# EAGLE board Utable_epaper_32seg_rev2 (EAGLE 6.5.0), part 1 of 2
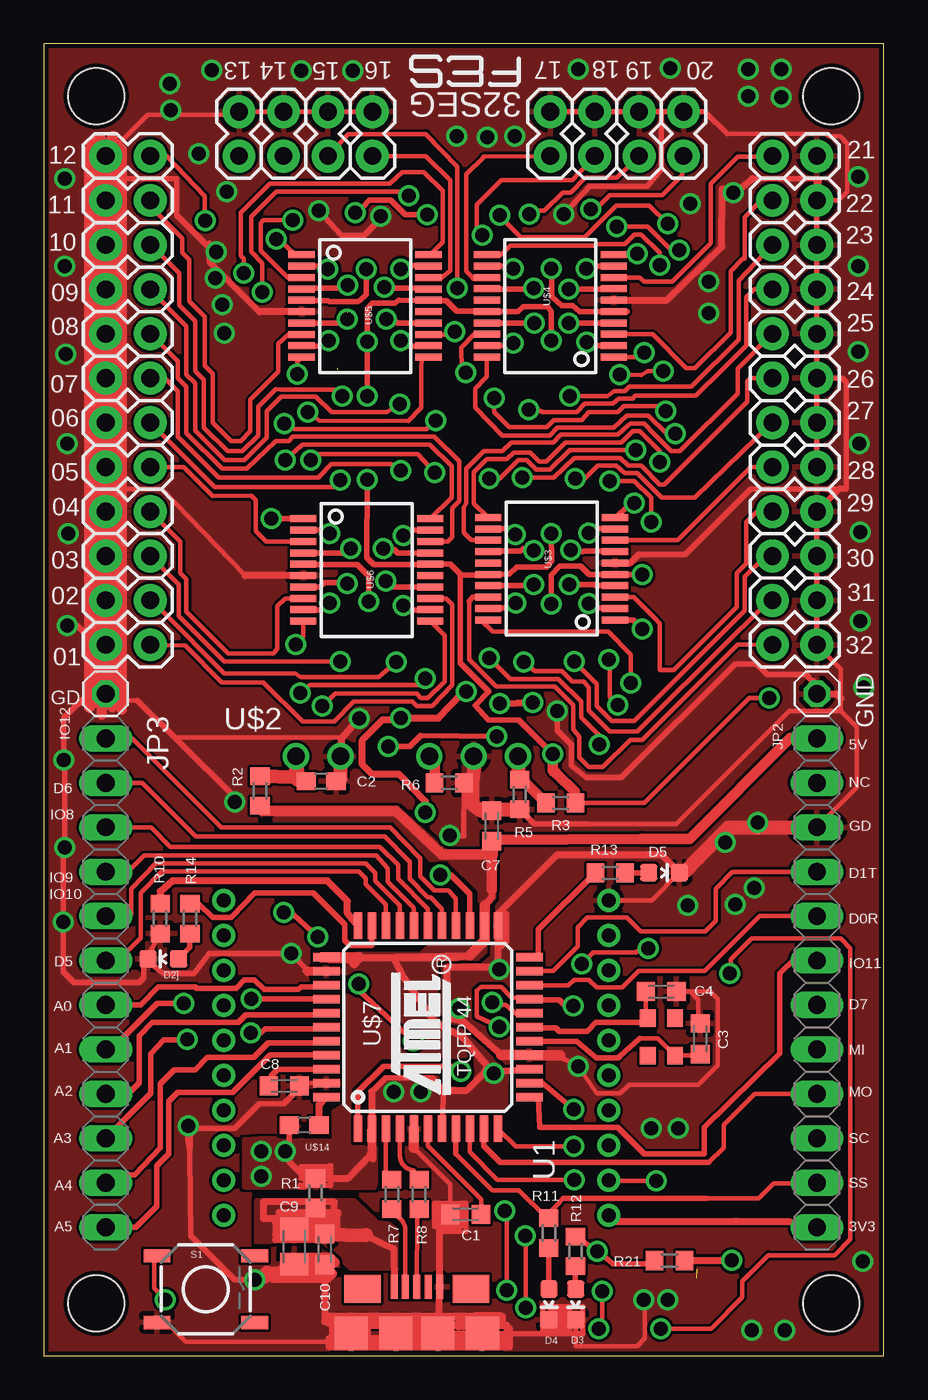
[diagram p2: board, top side]
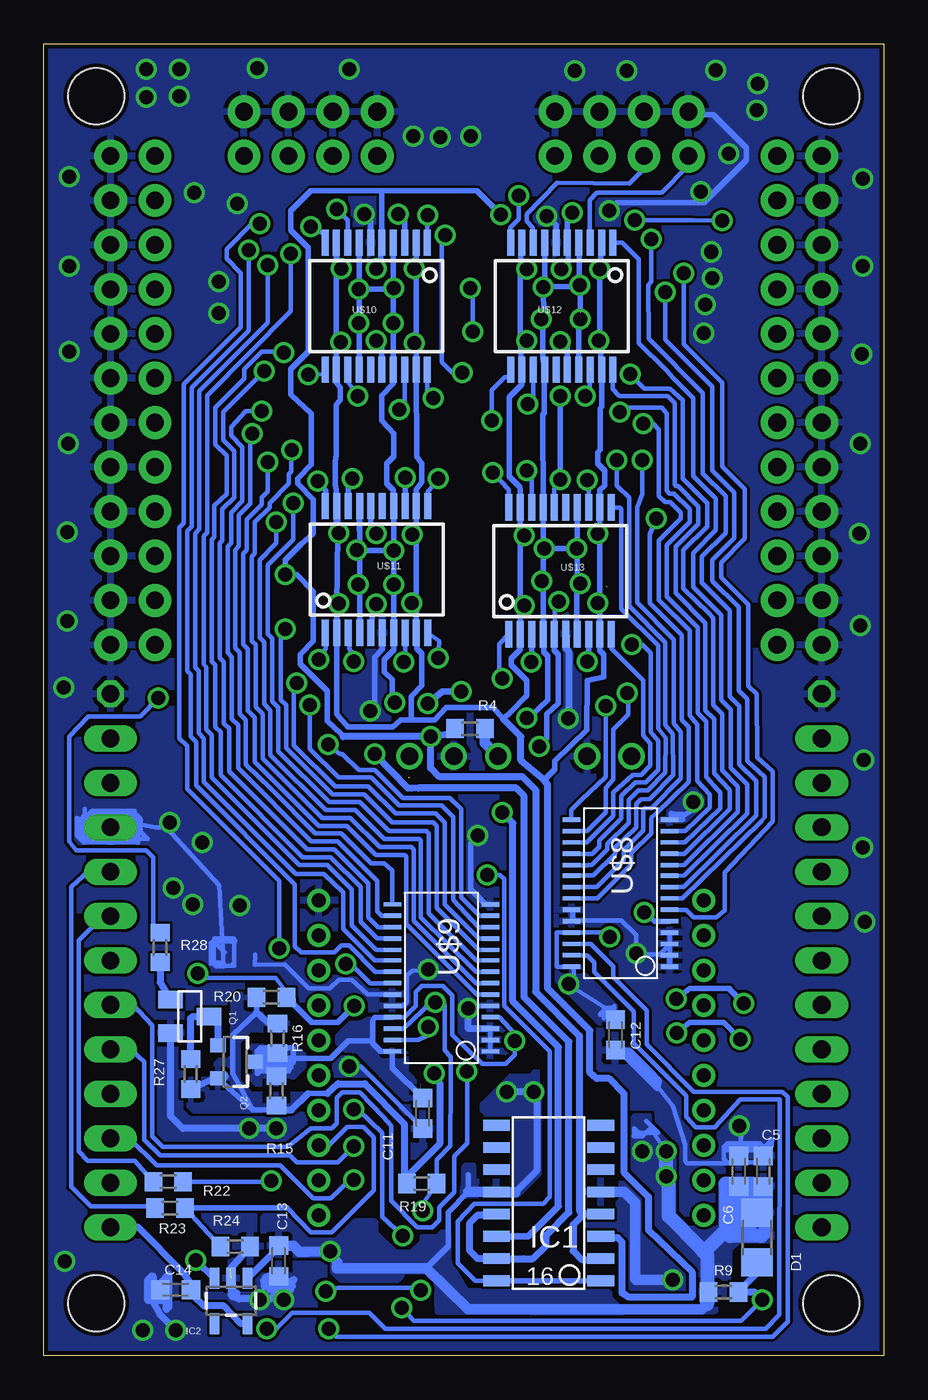
[diagram p3: board, bottom side, seen from below]

Size 48 x 75 mm. Coordinates in mm from the lower left corner, seen from the top.
Outline: 0,0 48,0 48,75 0,75 0,0
Copper layers (1*16): Top 0.035mm / dielectric 1.5mm / Bottom 0.035mm
Design rules "SeeedStudio_2layer_DRU_no_angle_20140221": minimum track width 6mil, minimum drill 12mil, track to track 6mil, track to pad 6mil, pad to pad 6mil, via to via 6mil, smd to smd 0mil, copper to edge 10mil, drill to drill 10mil, minimum pad ring 10mil, minimum via ring 6mil, stop-mask expansion 2mil, vias tented up to drill 100mil, thermal gap 10mil
Holes 3.2 mm at 45,3 3,3 3,72 45,72

## Footprints (pad centres in the part's own frame; a part is rotated, then mirrored left to right if it is on the bottom)
1X02 = drill 1.016 pad 1.88: 1 0,0; 2 2.54,0
C0603K = smd 1.05 x 1.08: 1 -0.875,0; 2 0.875,0
C0603 = smd 1.1 x 1: 1 -0.85,0; 2 0.85,0
C0805K = smd 1.3 x 1.6: 1 -1,0; 2 1,0
1206 = smd 1.6 x 1.803: 1 -1.422,0; 2 1.422,0
LED-0603 = smd 1 x 1: A 0,-0.877; C 0,0.877
1X01 = drill 1.016 octagon: 1 0,0
SO-16 = smd 0.61 x 1.524: 1 -4.445,-2.794; 2 -3.175,-2.794; 3 -1.905,-2.794; 4 -0.635,-2.794; 5 0.635,-2.794; 6 1.905,-2.794; 7 3.175,-2.794; 8 4.445,-2.794; 9 4.445,3.167; 10 3.175,3.167; 11 1.905,3.167; 12 0.635,3.167; 13 -0.635,3.167; 14 -1.905,3.167; 15 -3.175,3.167; 16 -4.445,3.167
SOT23-5 = smd 0.55 x 1.2: 1 -1.02,-1.3; 2 -0.07,-1.3; 3 0.88,-1.3; 4 0.88,1.3; 5 -1.02,1.3
1X12 = drill 1.016 long: 1 -13.97,0; 2 -11.43,0; 3 -8.89,0; 4 -6.35,0; 5 -3.81,0; 6 -1.27,0; 7 1.27,0; 8 3.81,0; 9 6.35,0; 10 8.89,0; 11 11.43,0; 12 13.97,0
SOT23 = smd 1 x 1.4: 1 -0.95,-1.1; 2 0.95,-1.1; 3 0,1.1
SOT23-3 = smd 0.8 x 0.9: 1 -0.95,-1; 2 0.95,-1; 3 0,1.1
R0603 = smd 1 x 1.1: 1 -0.85,0; 2 0.85,0
TACTILE-SWITCH-SMD = smd 1.524 x 0.762: 1 -2.794,1.905; 2 2.794,1.905; 3 -2.794,-1.905; 4 2.794,-1.905
XBEE = drill 0.8 pad 1.27: 1 -11,9; 2 -11,7; 3 -11,5; 4 -11,3; 5 -11,1; 6 -11,-1; 7 -11,-3; 8 -11,-5; 9 -11,-7; 10 -11,-9; 11 11,-9; 12 11,-7; 13 11,-5; 14 11,-3; 15 11,-1; 16 11,1; 17 11,3; 18 11,5; 19 11,7; 20 11,9
USB_MICRO_FCI = smd 0.4 x 1.35: D+ 0,2.675; D- -0.65,2.675; GND 1.3,2.675; ID 0.65,2.675; VBUS -1.3,2.675 | smd 1.9 x 1.9: P$6 -3.75,0; P$7 -1.2,0; P$8 1.2,0; P$9 3.75,0 | smd 2.1 x 1.6: P$10 -3.1,2.55; P$11 3.1,2.55
MAU109 = drill 1: P$1 0,0; P$2 2.54,0; P$4 7.62,0; P$5 10.16,0; P$6 12.7,0
SSOP20 = smd 0.4 x 1.5: 1 -0.015,0.645; 2 0.635,0.645; 3 1.285,0.645; 4 1.935,0.645; 5 2.585,0.645; 6 3.235,0.645; 7 3.885,0.645; 8 4.535,0.645; 9 5.185,0.645; 10 5.835,0.645; 11 5.835,7.895; 12 5.185,7.895; 13 4.535,7.895; 14 3.885,7.895; 15 3.235,7.895; 16 2.585,7.895; 17 1.935,7.895; 18 1.285,7.895; 19 0.635,7.895; 20 -0.015,7.895
TQFP44 = smd 1.5 x 0.5: 1 -5.8,4; 2 -5.8,3.2; 3 -5.8,2.4; 4 -5.8,1.6; 5 -5.8,0.8; 6 -5.8,0; 7 -5.8,-0.8; 8 -5.8,-1.6; 9 -5.8,-2.4; 10 -5.8,-3.2; 11 -5.8,-4; 23 5.8,-4; 24 5.8,-3.2; 25 5.8,-2.4; 26 5.8,-1.6; 27 5.8,-0.8; 28 5.8,0; 29 5.8,0.8; 30 5.8,1.6; 31 5.8,2.4; 32 5.8,3.2; 33 5.8,4 | smd 0.5 x 1.5: 12 -4,-5.8; 13 -3.2,-5.8; 14 -2.4,-5.8; 15 -1.6,-5.8; 16 -0.8,-5.8; 17 0,-5.8; 18 0.8,-5.8; 19 1.6,-5.8; 20 2.4,-5.8; 21 3.2,-5.8; 22 4,-5.8; 34 4,5.8; 35 3.2,5.8; 36 2.4,5.8; 37 1.6,5.8; 38 0.8,5.8; 39 0,5.8; 40 -0.8,5.8; 41 -1.6,5.8; 42 -2.4,5.8; 43 -3.2,5.8; 44 -4,5.8
PCA9635 = smd 0.25 x 1: 1 0.65,-0.6; 2 1.3,-0.6; 3 1.95,-0.6; 4 2.6,-0.6; 5 3.25,-0.6; 6 3.9,-0.6; 7 4.55,-0.6; 8 5.2,-0.6; 9 5.85,-0.6; 10 6.45,-0.6; 11 7.1,-0.6; 12 7.75,-0.6; 13 8.4,-0.6; 14 9.05,-0.6; 15 9.05,5; 16 8.4,5; 17 7.75,5; 18 7.1,5; 19 6.45,5; 20 5.85,5; 21 5.2,5; 22 4.55,5; 23 3.9,5; 24 3.25,5; 25 2.6,5; 26 1.95,5; 27 1.3,5; 28 0.65,5
0603 = smd 1.1 x 1: 1 -0.85,0; 2 0.85,0
OSCILLATOR-3225 = smd 1 x 0.9: P$1 0,0; P$2 2.15,0; P$3 2.15,1.55; P$4 0,1.55

## Placement (x,y rotation side)
01  M02PTH  [1X02]  6.08,40.64 180 top
02  M02PTH  [1X02]  6.08,43.18 180 top
03  M02PTH  [1X02]  6.08,45.72 180 top
04  M02PTH  [1X02]  6.08,48.26 180 top
05  M02PTH  [1X02]  6.08,50.8 180 top
06  M02PTH  [1X02]  6.08,53.34 180 top
07  M02PTH  [1X02]  6.08,55.88 180 top
08  M02PTH  [1X02]  6.08,58.42 180 top
09  M02PTH  [1X02]  6.08,60.96 180 top
10  M02PTH  [1X02]  6.08,63.5 180 top
11  M02PTH  [1X02]  6.08,66.04 180 top
12  M02PTH  [1X02]  6.08,68.58 180 top
13  M02PTH  [1X02]  11.16,68.58 90 top
14  M02PTH  [1X02]  13.7,68.58 90 top
15  M02PTH  [1X02]  16.24,68.58 90 top
16  M02PTH  [1X02]  18.78,68.58 90 top
17  M02PTH  [1X02]  28.94,68.58 90 top
18  M02PTH  [1X02]  31.48,68.58 90 top
19  M02PTH  [1X02]  34.02,68.58 90 top
20  M02PTH  [1X02]  36.56,68.58 90 top
21  M02PTH  [1X02]  41.64,68.58 0 top
22  M02PTH  [1X02]  41.64,66.04 0 top
23  M02PTH  [1X02]  41.64,63.5 0 top
24  M02PTH  [1X02]  41.64,60.96 0 top
25  M02PTH  [1X02]  41.64,58.42 0 top
26  M02PTH  [1X02]  41.64,55.88 0 top
27  M02PTH  [1X02]  41.64,53.34 0 top
28  M02PTH  [1X02]  41.64,50.8 0 top
29  M02PTH  [1X02]  41.64,48.26 0 top
30  M02PTH  [1X02]  41.64,45.72 0 top
31  M02PTH  [1X02]  41.64,43.18 0 top
32  M02PTH  [1X02]  41.64,40.64 0 top
C1  1u  [C0603K]  24.1,8.09 0 top
C2  1u  [C0603]  15.85,32.85 0 top
C3  22p  [C0603K]  37.51,18.12 90 top
C4  22p  [C0603K]  35.27,20.82 180 top
C5  0.1u  [C0603K]  6.89,10.55 90 bottom
C6  0.1u  [C0603K]  8.29,10.55 90 bottom
C7  1u  [C0603K]  25.6,30.28 270 top
C8  0.1u  [C0603K]  13.73,15.43 180 top
C9  22u  [C0805K]  14.32,6.24 270 top
C10  0.1u  [C0603K]  16.05,6.08 270 top
C11  1u  [C0603K]  26.35,13.86 90 bottom
C12  1u  [C0603K]  15.33,18.34 90 bottom
C13  1u  [C0603K]  34.58,5.42 90 bottom
C14  1u  [C0603K]  40.47,3.77 0 bottom
D1  CD1206-S01575  [1206]  7.25,6.76 90 bottom
D2]  GREEN  [LED-0603]  6.83,22.68 90 top
D3  GREEN  [LED-0603]  30.39,2.94 180 top
D4  Yellow  [LED-0603]  28.88,2.94 180 top
D5  Yellow  [LED-0603]  35.45,27.61 270 top
GD  [1X01]  3.54,37.84 0 top
GND  [1X01]  44.18,37.84 0 top
IC1  ADG211ASO-16  [SO-16]  18.97,8.73 90 bottom
IC2  AAT3221IGV-3.3-T1  [SOT23-5]  37.37,3.13 180 bottom
JP2  [1X12]  44.18,21.32 270 top
JP3  [1X12]  3.54,21.32 270 top
Q1  MOSFET-NCHANNELBSS138  [SOT23]  39.65,19.4 270 bottom
Q2  MOSFET-PCHANNELIRLML2244  [SOT23-3]  37.05,16.8 270 bottom
R1  [R0603]  15.53,9.3 270 top
R2  0  [R0603]  12.35,32.29 90 top
R3  0  [R0603]  29.54,31.6 0 top
R4  0  [R0603]  23.64,35.85 0 bottom
R5  10k  [R0603]  27.2,32.08 90 top
R6  10k  [R0603]  23.17,32.74 180 top
R7  22  [R0603]  19.89,9.23 270 top
R8  22  [R0603]  21.45,9.23 270 top
R9  10k  [R0603]  9.16,3.65 0 bottom
R10  10k  [R0603]  6.65,24.99 270 top
R11  1k  [R0603]  28.86,7.01 270 top
R12  1k  [R0603]  30.38,5.96 90 top
R13  1k  [R0603]  32.38,27.6 0 top
R14  1k  [R0603]  8.36,24.99 270 top
R15  0  [R0603]  34.7,15.15 270 bottom
R16  0  [R0603]  34.65,18.15 90 bottom
R19  10k  [R0603]  26.4,9.84 180 bottom
R20  10k  [R0603]  34.99,20.49 180 bottom
R21  10k  [R0603]  35.76,5.45 180 top
R22  10k  [R0603]  40.89,9.95 180 bottom
R23  5.6k  [R0603]  40.79,8.45 0 bottom
R24  10k  [R0603]  37.06,6.25 0 bottom
R27  10k  [R0603]  39.6,16.1 270 bottom
R28  0  [R0603]  41.35,23.35 90 bottom
S1  SWITCH-MOMENTARY-2SMD  [TACTILE-SWITCH-SMD]  9.26,3.81 0 top
U1  RN4142XV-DS  [XBEE]  21.27,17.04 180 top
U$1  USB_MICRO_FCI  [USB_MICRO_FCI]  21.32,1.27 0 top
U$2  MAU109  [MAU109]  14.41,34.27 0 top
U$3  ADG1334  [SSOP20]  33.29,42.08 90 top
U$4  ADG1334  [SSOP20]  33.22,57.1 90 top
U$5  ADG1334  [SSOP20]  14.09,62.92 270 top
U$6  ADG1334  [SSOP20]  14.19,47.83 270 top
U$7  ATMEGA32U4-AU  [TQFP44]  21.95,18.78 90 top
U$8  PCA9635  [PCA9635]  12.83,21.59 90 bottom
U$9  PCA9635  [PCA9635]  23.08,16.75 90 bottom
U$10  ADG1334  [SSOP20]  26.09,64.27 180 bottom
U$11  ADG1334  [SSOP20]  31.89,40.68 0 bottom
U$12  ADG1334  [SSOP20]  15.49,64.27 180 bottom
U$13  ADG1334  [SSOP20]  21.4,40.6 0 bottom
U$14  FB  [0603]  14.88,13.19 180 top
Y1  16MHz  [OSCILLATOR-3225]  36.06,17.16 90 top